# EAGLE design CombinedVentSchem (EAGLE 9.6.2)
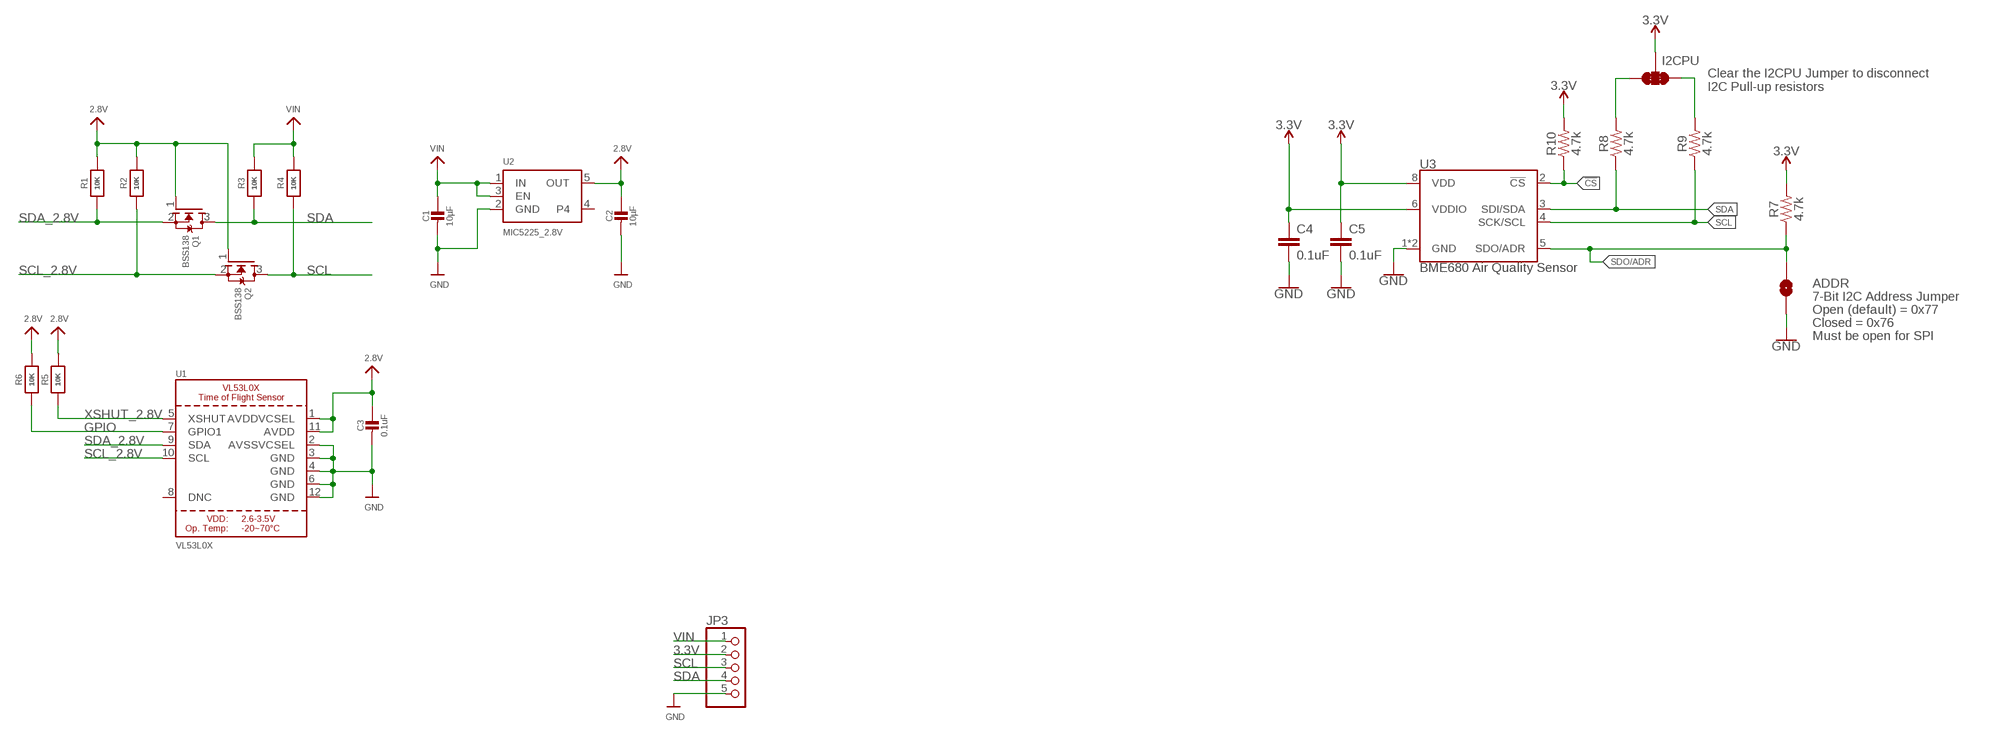
[diagram p0: schematic, sheet 1]

## Parts
ADDR  JUMPER-SMT_2_NO_SILK  [SMT-JUMPER_2_NO_SILK]
C1  10µF  CAP_CERAMIC0805-NOOUTLINE  [0805-NO]
C2  10µF  CAP_CERAMIC0805-NOOUTLINE  [0805-NO]
C3  0.1uF  CAP_CERAMIC0805-NOOUTLINE  [0805-NO]
C4  0.1uF  0.1UF-0603-100V-10%  [0603]
C5  0.1uF  0.1UF-0603-100V-10%  [0603]
I2CPU  I2C PU  JUMPER-SMT_3_2-NC_TRACE_SILK  [SMT-JUMPER_3_2-NC_TRACE_SILK]
JP3  PINHD-1X55X2MM  [1_05X2MM]
Q1  BSS138  MOSFET-NWIDE  [SOT23-WIDE]
Q2  BSS138  MOSFET-NWIDE  [SOT23-WIDE]
R1  10K  RESISTOR0805_NOOUTLINE  [0805-NO]
R2  10K  RESISTOR0805_NOOUTLINE  [0805-NO]
R3  10K  RESISTOR0805_NOOUTLINE  [0805-NO]
R4  10K  RESISTOR0805_NOOUTLINE  [0805-NO]
R5  10K  RESISTOR0805_NOOUTLINE  [0805-NO]
R6  10K  RESISTOR0805_NOOUTLINE  [0805-NO]
R7  4.7k  4.7KOHM-0603-1/10W-1%  [0603@1]
R8  4.7k  4.7KOHM-0603-1/10W-1%  [0603@1]
R9  4.7k  4.7KOHM-0603-1/10W-1%  [0603@1]
R10  4.7k  4.7KOHM-0603-1/10W-1%  [0603@1]
U1  VL53L0X  [LGA12_ST]
U2  MIC5225_2.8V  VREG_SOT23-5  [SOT23-5]
U3  BME680 Air Quality Sensor  BME680-LGA  [LGA3.0X3.0]

## Nets
2.8V: C2.1 C3.1 Q1.1(G) Q2.1(G) R1.2 R2.2 R5.2 R6.2 U1.1(AVDDVCSEL) U1.11(AVDD) U2.5(OUT)
3.3V: C4.1 C5.1 I2CPU.2 JP3.2 R7.2 R10.2 U3.6(VDDIO) U3.8(VDD)
!CS: R10.1 U3.2(!CS)
GND: ADDR.1 C1.2 C2.2 C3.2 C4.2 C5.2 JP3.5 U1.2(AVSSVCSEL) U1.3(GND) U1.4(GND) U1.6(GND) U1.12(GND) U2.2(GND) U3.1(GND) U3.7(GND)
GPIO: R6.1 U1.7(GPIO1)
N$4: I2CPU.3 R8.2
N$5: I2CPU.1 R9.2
SCL: JP3.3 Q2.3(D) R4.1 R9.1 U3.4(SCK/SCL)
SCL_2.8V: Q2.2(S) R2.1 U1.10(SCL)
SDA: JP3.4 Q1.3(D) R3.1 R8.1 U3.3(SDI/SDA)
SDA_2.8V: Q1.2(S) R1.1 U1.9(SDA)
SDO/ADR: ADDR.2 R7.1 U3.5(SDO/ADR)
VIN: C1.1 JP3.1 R3.2 R4.2 U2.1(IN) U2.3(EN)
XSHUT_2.8V: R5.1 U1.5(XSHUT)
Unconnected: U1.8(DNC) U2.4

## Notes on the sheet
- Clear the I2CPU Jumper to disconnect
  I2C Pull-up resistors
- 7-Bit I2C Address Jumper
- Open (default) = 0x77
- Closed = 0x76
- Must be open for SPI

## Library data of the parts
ADDR = SparkFun-Jumpers:JUMPER-SMT_2_NO: Normally open jumper This jumper has two pads in close proximity to each other. Apply solder to close the connection. Round pads are easier to solder for beginners, but are a lot larger. SparkFun Product that uses the round pads: SparkFun EL Sequencer <https://www.sparkfun.com/products/12781>
C1-C3 = microbuilder:CAP_CERAMIC: Ceramic Capacitors For new designs, use the packages preceded by an '_' character since they are more reliable: The following footprints should be used on most boards: _0402 - Standard footprint for regular board layouts _0603 - Standard footprint for regular board layouts _0805 - Standard footprint for regular board layouts _1206 - Standard footprint for regular board layouts For extremely tight-pitch boards where space is at a premium, the following 'micro-pitch' footprints can be used (smaller pads, no silkscreen outline, etc.): _0402MP - Micro-pitch footprint for very dense/compact boards _0603MP - Micro-pitch footprint for very dense/compact boards _0805MP - Micro-pitch footprint for very dense/compact boards _1206MP - Micro-pitch footprint for very dense/compact boards
C4 C5 = SparkFun-Capacitors:0.1UF: 0.1µF ceramic capacitors A capacitor is a passive two-terminal electrical component used to store electrical energy temporarily in an electric field.; PROD_ID: CAP-08390
I2CPU = SparkFun-Jumpers:JUMPER-SMT_3_2-NC_TRACE: Normally closed trace jumper (2 of 2 connections) This jumper has a trace between all three pads so they are normally closed (NC). Use a razor knife to open the connection(s). For best results follow the IPC guidelines for cutting traces: Cutout at least 0.063 mm (0.005 in). Remove all loose material to clean up the cut area. Seal the cut with an approved epoxy. Reapply solder to reclose the connection(s).
JP3 = pinhead:PINHD-1X5: PIN HEADER
Q1 Q2 = microbuilder:MOSFET-N: N-Channel Mosfet LEGEND VDS: Voltage Drain-Source ID: Drain Current RDS(ON): Drain-Source On-State Resistance VGS(TH): Gate-Source Threshold Voltage CISS: Drain-Source Input Capacitance SOT-23 Name VDS ID RDS(ON) VGS(TH) CISS Order Number 2N7002E 60V 260mA 2.5 Ohm 2.5V @ 250uA 26.7pF @ 25V 2N7002ET1GOSTR-ND BSH103 30V 850mA 400 mOhm 400mV @ 1mA 83pF @ 24V BSH103,235-ND BSS138 60V 320mA 1.6 Ohm 1.5V @ 250uA 50pF @ 10V Mouser: 771-BSS138PW115 DMN2075U-7 20V 4.2A 38 mOhm 1V @ 250 uA 594.3pF @ 10V DMN2075U-7DICT-ND * BSS138 good choice for I2C level-shifting POWERPAK 1212-8 Name VDS ID RDS(ON) VGS(TH) CISS Order Number Si7308DN 60V 6A 58 mOhm 3V @ 250uA 665pF @ 15V SI7308DN-T1-E3CT-ND
R1-R6 = microbuilder:RESISTOR: Resistors For new designs, use the packages preceded by an '_' character since they are more reliable: The following footprints should be used on most boards: _0402 - Standard footprint for regular board layouts _0603 - Standard footprint for regular board layouts _0805 - Standard footprint for regular board layouts _1206 - Standard footprint for regular board layouts For extremely tight-pitch boards where space is at a premium, the following 'micro-pitch' footprints can be used (smaller pads, no silkscreen outline, etc.): _0402MP - Micro-pitch footprint for very dense/compact boards _0603MP - Micro-pitch footprint for very dense/compact boards _0805MP - Micro-pitch footprint for very dense/compact boards _1206MP - Micro-pitch footprint for very dense/compact boards
R7-R10 = SparkFun-Resistors:4.7KOHM: 4.7kΩ resistor A resistor is a passive two-terminal electrical component that implements electrical resistance as a circuit element. Resistors act to reduce current flow, and, at the same time, act to lower voltage levels within circuits. - Wikipedia; PROD_ID: RES-07857
U1 = microbuilder:VL53L0X: VL53L0X - Laser Time of Flight Sensor (2M range)
U2 = microbuilder:VREG_SOT23-5: SOT23-5 Fixed Voltage Regulators Part Current Out V Out V In V Dropout θJA (°C/W) TJ (°C) Digikey Part No. ADP121 150mA 3.3V 3.4-5.5V 0.09V @ 150mA -- -- ADP121-AUJZ33R7CT-ND ADP121 150mA 3.0V 3.1-5.5V 0.09V @ 150mA -- -- ADP121-AUJZ30R7CT-ND ADP122 300mA 3.3V 3.4-5.5V 0.085V @ 300mA -- -- ADP122AUJZ-3.3-R7CT-ND ADP1712 300mA 3.3V 3.5-5.5V 0.17V @ 300mA -- -- ADP1712AUJZ-3.3-R7TR-ND AP7311 (Low Cost) 150mA 3.3V 3.5-6V 0.15V @ 150mA -- -- AP7311-33WG-7DICT-ND LD39015M18R 150mA 1.8V 1.9V-5.5V 0.08V @ 100mA -- -- 497-6977-1-ND LP2985A-33DBVR 150mA 3.3V 3.3-16V 0.28V @ 150mA 206 150 296-18479-1-ND MCP1824T-3302E/OT 300mA 3.3V 3.5V-6V 0.2V @ 300mA -- -- MCP1824T-3302E/OTCT-ND MIC5205-2.5YM5 TR 150mA 2.5V 2.7-16V 0.165V @ 150mA -- -- 576-1257-2-ND MIC5205-3.0YM5 TR 150mA 3.0V 3.2V-16V 0.165V @ 150mA -- -- 576-1258-2-ND MIC5205-3.3YM5 TR 150mA 3.3V 3.5V-16V 0.165V @ 150mA -- -- 576-1259-2-ND TPS780330220 150mA 3.3V+2.2V 3.6-5.5V 250mV Max -- -- 296-23332-1-ND TDA3663/N1,135 100mA 3.3V 3.5-45V 0.18V @ 50mA -- -- 568-5343-1-ND Max operating temp can be calculated using θJA, TJ (max junction temperature), and power in watts. Set the "Maximum Ambient Temperature" until it reaches TJ ("Max Junction Temperature"), which is the absolute limit for safe use of the regulator: Heat Sink Temperature Calculator <http://www.daycounter.com/Calculators/Heat-Sink-Temperature-Calculator.phtml> For example, With 12V source into a 3.3V LP2985 and a 30mA load, we are dissipating (12V-3.3V) * 0.03A = 0.261W. With a θJA of 206 °C/W, a TJ of 150°C, and 261mW we can safely use the chip without a heat sink up to 75°C (=147.1°C Junction Temperature).
U3 = SparkFun-Sensors:BME680: Bosch BME680 – Combined Humidity and Pressure Sensor The BME680 is as combined digital humidity, pressure and temperature sensor based on proven sensing principles. The sensor module is housed in an extremely compact metal-lid LGA package with a footprint of only 3.0×3.0mm with a height of 0.93mm. Its small dimensions and its low power consumption allow the implementation in battery driven devices such as handsets, GPS modules or watches.; PROD_ID: IC-14656; VALUE: BME680

## Board
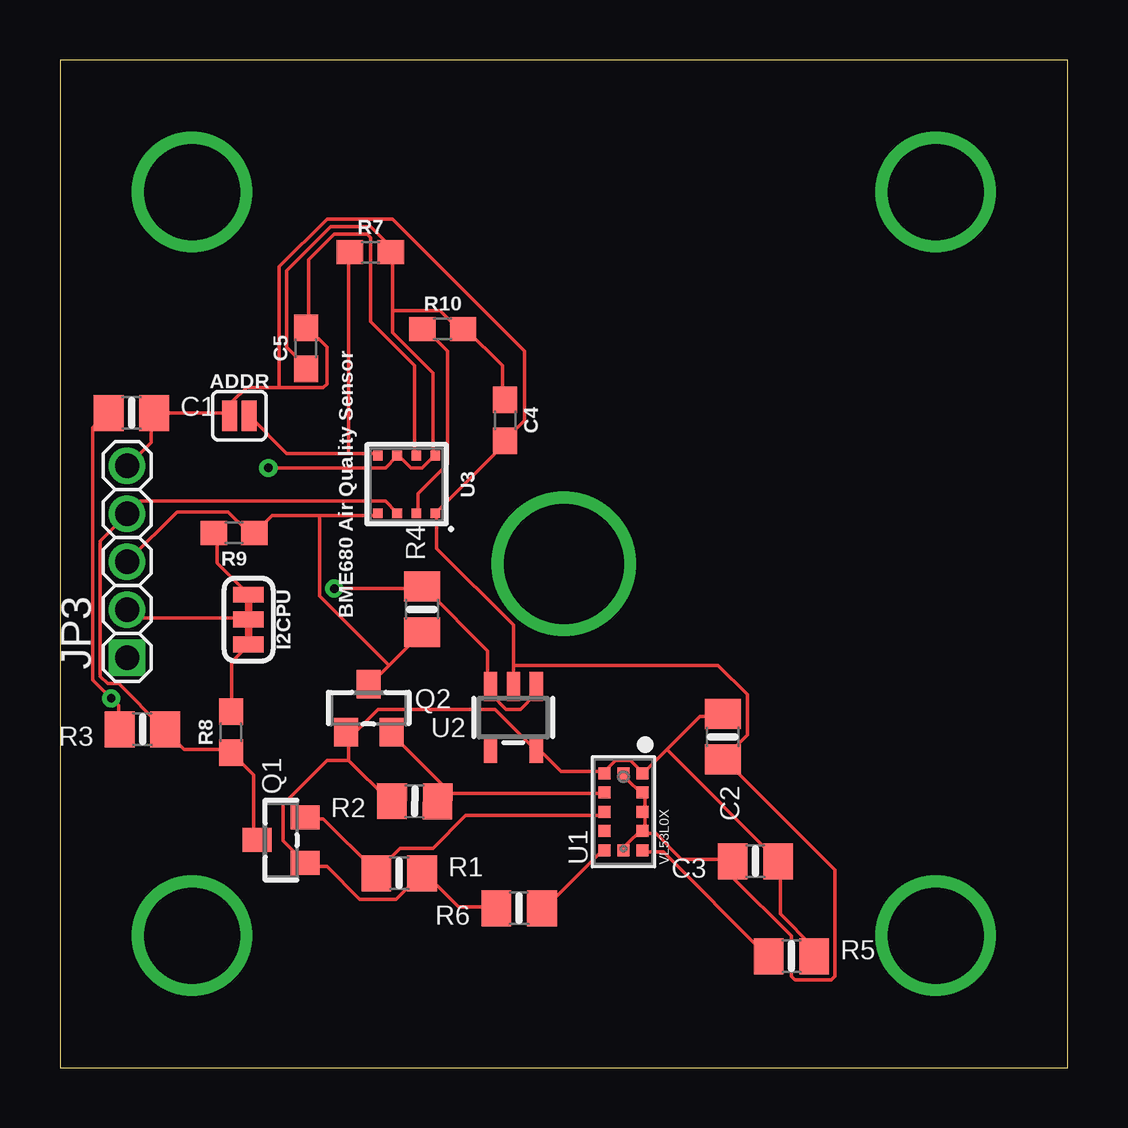
[diagram p1: board, top side]
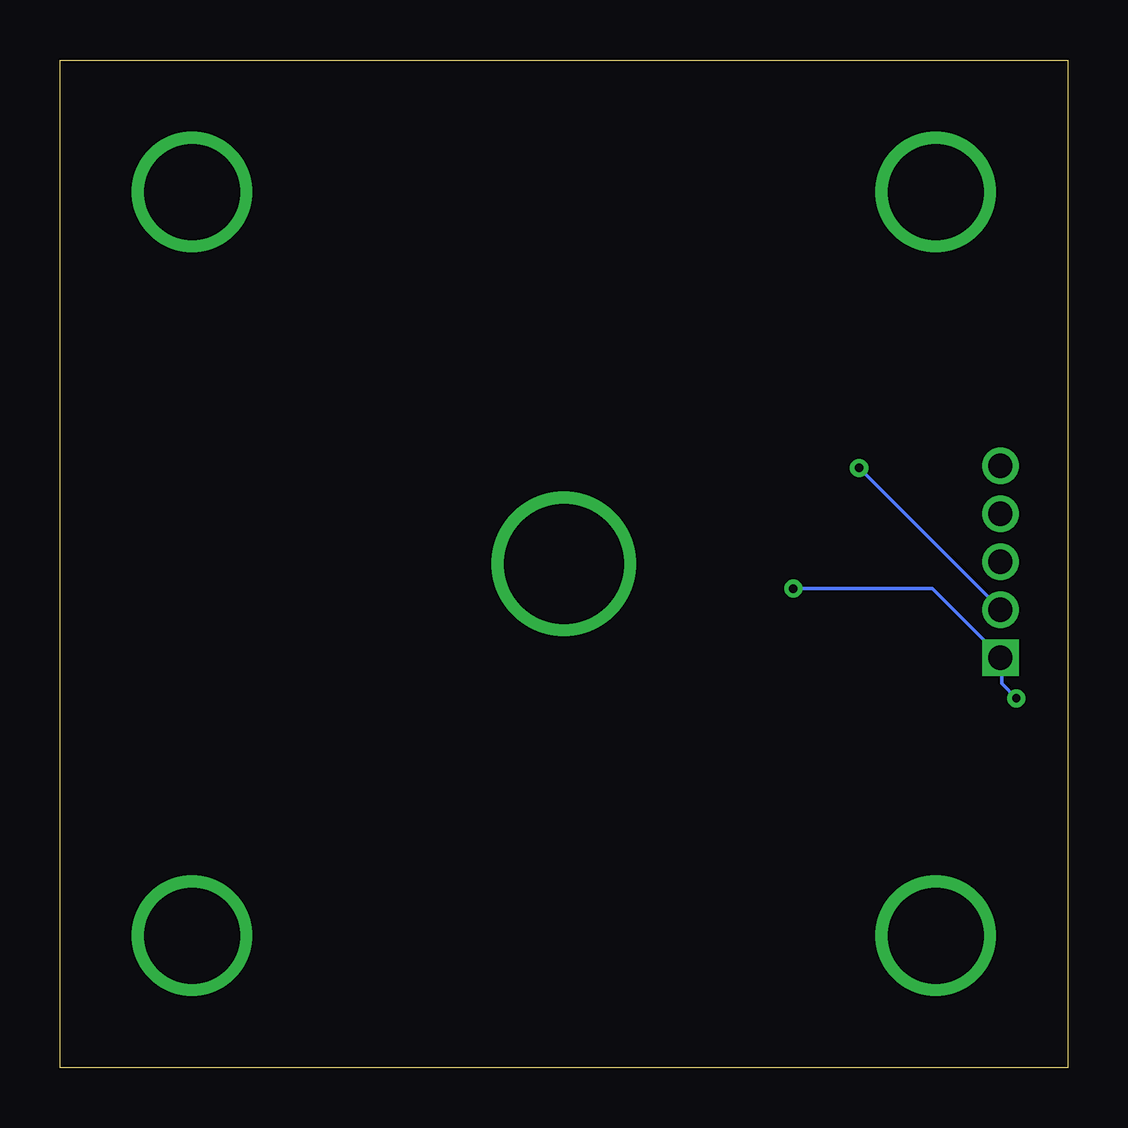
[diagram p2: board, bottom side, seen from below]

Size 42 x 42 mm. Coordinates in mm from the lower left corner, seen from the top.
Outline: 0,0 42,0 42,42 0,42 0,0
Copper layers (1*16): Top 0.035mm / dielectric 1.5mm / Bottom 0.035mm
Design rules "default": minimum track width 6mil, minimum drill 0.35mm, track to track 6mil, track to pad 6mil, pad to pad 6mil, via to via 6mil, smd to smd 6mil, copper to edge 40mil, drill to drill 6mil, minimum pad ring 10mil, minimum via ring 8mil, stop-mask expansion 4mil, vias tented up to drill 0mil, thermal gap 10mil

### Footprints (pad centres in the part's own frame; a part is rotated, then mirrored left to right if it is on the bottom)
SMT-JUMPER_2_NO_SILK = smd 0.635 x 1.27: 1 -0.406,0; 2 0.406,0
0805-NO = smd 1.24 x 1.5: 1 -0.95,0; 2 0.95,0
0603 = smd 1.1 x 1: 1 -0.85,0; 2 0.85,0
SMT-JUMPER_3_2-NC_TRACE_SILK = smd 0.66 x 1.27: 1 -1.041,0; 2 0,0; 3 1.041,0
1_05X2MM = drill 1.016 pad 1.3 square: 1 -4,0 | drill 1.016 pad 1.3: 2 -2,0; 3 0,0; 4 2,0; 5 4,0
SOT23-WIDE = smd 1 x 1.2: 1 -0.95,-1; 2 0.95,-1; 3 0,1
0603@1 = smd 1.1 x 1: 1 -0.85,0; 2 0.85,0
LGA12_ST = smd 0.5 x 0.5: 1 1.6,-0.8; 2 0.8,-0.8; 3 0,-0.8; 4 -0.8,-0.8; 5 -1.6,-0.8; 6 -1.6,0; 7 -1.6,0.8; 8 -0.8,0.8; 9 0,0.8; 10 0.8,0.8; 11 1.6,0.8; 12 1.6,0
SOT23-5 = smd 0.55 x 1.2: 1 -0.95,-1.3; 2 0,-1.3; 3 0.95,-1.3; 4 0.95,1.3; 5 -0.95,1.3
LGA3.0X3.0 = smd 0.4 x 0.4: 1 1.2,1.2; 2 1.2,0.4; 3 1.2,-0.4; 4 1.2,-1.2; 5 -1.2,-1.2; 6 -1.2,-0.4; 7 -1.2,0.4; 8 -1.2,1.2

### Placement (x,y rotation side)
ADDR  7.48,27.17 0 top
C1  2.98,27.29 0 top
C2  27.63,13.79 270 top
C3  28.99,8.6 180 top
C4  18.56,26.98 270 top
C5  10.25,29.98 90 top
I2CPU  7.86,18.67 270 top
JP3  2.8,21.09 90 top
Q1  9.22,9.48 90 top
Q2  12.87,14.98 0 top
R1  14.14,8.1 0 top
R2  14.79,11.1 179.5 top
R3  3.44,14.1 180 top
R4  15.09,19.1 90 top
R5  30.49,4.64 0 top
R6  19.14,6.64 180 top
R7  12.94,33.98 0 top
R8  7.13,13.98 90 top
R9  7.26,22.29 180 top
R10  15.95,30.79 0 top
U1  23.49,10.66 90 top
U2  18.9,14.59 180 top
U3  14.45,24.31 270 top

### Tracks (layer width: path | path; a pad name or v marks a point on that pad's centre or on a via)
2.8V
  Top 0.152: 12.04,12.8 12.04,13.87 Q2.1 12.04,14.02 12.34,14.02 13.26,14.94 18.14,14.94 19.81,13.26 U2.5 19.96,13.26 20.88,12.34 22.55,12.34 U1.11 22.71,12.34 23.16,12.8 23.77,12.8 24.23,12.34 U1.1 24.38,12.34 25.3,13.26 | 12.04,12.8 13.72,11.12 R2.2 | R6.2 18.14,6.71 16.61,6.71 15.24,8.08 R1.2 15.09,8.08 14.02,7.01 12.5,7.01 11.12,8.38 10.36,8.38 Q1.1 9.3,9.45 9.3,10.97 11.12,12.8 12.04,12.8 | R5.2 31.39,4.72 31.39,5.03 30.02,6.4 30.02,8.53 C3.1 29.87,8.69 25.3,13.26 | 25.3,13.26 26.67,14.63 27.58,14.63 C2.1
3.3V  (via drill 0.35)
  Top 0.152: I2CPU.2 7.77,18.75 3.2,18.75 2.9,19.05 JP3.2 | 13.87,31.55 13.87,33.83 R7.2 13.72,33.98 13.72,34.29 12.95,35.05 11.28,35.05 9.45,33.22 9.45,30.02 10.21,29.26 C5.1 | 13.87,31.55 13.87,30.63 15.54,28.96 15.54,25.6 U3.8 15.54,25.45 15.09,24.99 14.63,24.99 14.17,25.45 U3.6 14.02,25.45 13.56,24.99 v8.69,24.99 | 13.87,31.55 15.85,31.55 16.46,30.94 16.76,30.94 R10.2 16.92,30.79 18.44,29.26 18.44,27.89 C4.1
  Bottom 0.152: v8.69,24.99 2.9,19.2 JP3.2
!CS
  Top 0.152: U3.2 14.94,23.16 14.94,23.93 16.15,25.15 16.15,29.87 15.24,30.79 R10.1
GND
  Top 0.152: JP3.5 2.9,25.15 3.81,26.06 3.81,27.28 C1.2 3.96,27.28 7.01,27.28 ADDR.1 7.16,27.28 7.16,27.74 7.77,28.35 9.14,28.35 | U3.7 14.78,25.6 14.78,29.26 12.95,31.09 12.95,34.59 12.8,34.75 11.43,34.75 10.36,33.68 10.36,30.94 C5.2 10.36,30.79 11.12,30.02 11.12,28.5 10.97,28.35 9.14,28.35 | U1.6 23.62,9.14 23.62,9.3 24.23,9.91 U1.4 | U1.4 24.38,9.91 24.38,10.52 U1.3 24.38,10.67 24.38,11.43 U1.2 24.23,11.43 23.62,12.04 23.62,12.19 U1.12 | U1.4 24.38,9.75 24.84,9.75 25.91,8.69 27.89,8.69 C3.2 28.04,8.53 28.04,7.92 30.48,5.49 30.48,3.81 30.63,3.66 32.16,3.66 32.31,3.81 32.31,8.23 27.74,12.8 C2.2 27.74,12.95 28.65,13.87 28.65,15.54 27.43,16.76 18.9,16.76 | 18.9,16.76 18.9,18.44 15.7,21.64 15.7,23.01 U3.1 15.7,23.16 18.59,26.06 C4.2 18.59,26.21 19.36,26.98 19.36,29.87 13.87,35.36 11.12,35.36 9.14,33.38 9.14,28.35 | 18.9,16.76 18.9,16 U2.2
GPIO
  Top 0.152: U1.7 22.55,8.99 20.12,6.55 R6.1
N$2  (via drill 4 pad 4.5)
  other vias: 5.5,5.5
N$4
  Top 0.152: R8.2 7.16,14.94 7.16,16.92 7.77,17.53 I2CPU.3
N$5
  Top 0.152: R9.2 6.55,22.25 6.55,21.03 7.77,19.81 I2CPU.1
N$6  (via drill 4 pad 4.5)
  other vias: 5.5,36.5
N$7  (via drill 4 pad 4.5)
  other vias: 36.5,36.5
N$8  (via drill 4 pad 4.5)
  other vias: 36.5,5.5
N$9  (via drill 5 pad 5.5)
  other vias: 21,21
SCL
  Top 0.152: 13.72,16.76 15.09,18.14 R4.1 | 13.72,16.76 12.95,16 Q2.3 | 10.82,23.01 8.84,23.01 8.23,22.4 R9.1 8.08,22.4 7.77,22.4 7.01,23.16 4.88,23.16 2.9,21.18 JP3.3 | 10.82,23.01 13.11,23.01 U3.4 | 13.72,16.76 10.82,19.66 10.82,23.01
SCL_2.8V
  Top 0.152: 16.31,11.43 16.15,11.43 15.85,11.12 R2.1 16.31,11.43 | 16.31,11.43 22.55,11.43 U1.10 | 16.31,11.43 13.87,13.87 Q2.2
SDA
  Top 0.152: Q1.3 8.08,9.6 8.08,12.19 7.16,13.11 R8.1 7.01,13.26 5.18,13.26 4.42,14.02 R3.1 4.27,14.17 2.44,16 1.98,16 1.68,16.31 1.68,21.95 2.74,23.01 JP3.4 2.9,23.16 3.35,23.62 13.56,23.62 14.02,23.16 U3.3
SDA_2.8V
  Top 0.152: U1.9 22.55,10.52 16.92,10.52 15.54,9.14 14.17,9.14 13.26,8.23 R1.1 13.11,8.23 10.97,10.36 10.36,10.36 Q1.2
SDO/ADR
  Top 0.152: 12.04,25.6 9.45,25.6 7.92,27.13 ADDR.2 | 12.04,25.6 13.11,25.6 U3.5 | 12.04,25.6 12.04,33.83 R7.1
VIN  (via drill 0.35)
  Top 0.152: U2.1 19.81,15.85 19.81,15.54 19.2,14.94 18.59,14.94 17.98,15.54 17.98,15.85 U2.3 17.83,16 17.83,17.37 15.24,19.96 R4.2 15.09,19.96 v11.43,19.96 | R3.2 2.44,14.17 2.44,15.09 v2.13,15.39 1.37,16.15 1.37,26.67 1.98,27.28 C1.1
  Bottom 0.152: v2.13,15.39 2.74,16 2.74,17.07 JP3.1 2.9,17.22 5.64,19.96 v11.43,19.96
XSHUT_2.8V
  Top 0.152: U1.5 24.38,8.99 25.15,8.99 29.41,4.72 R5.1